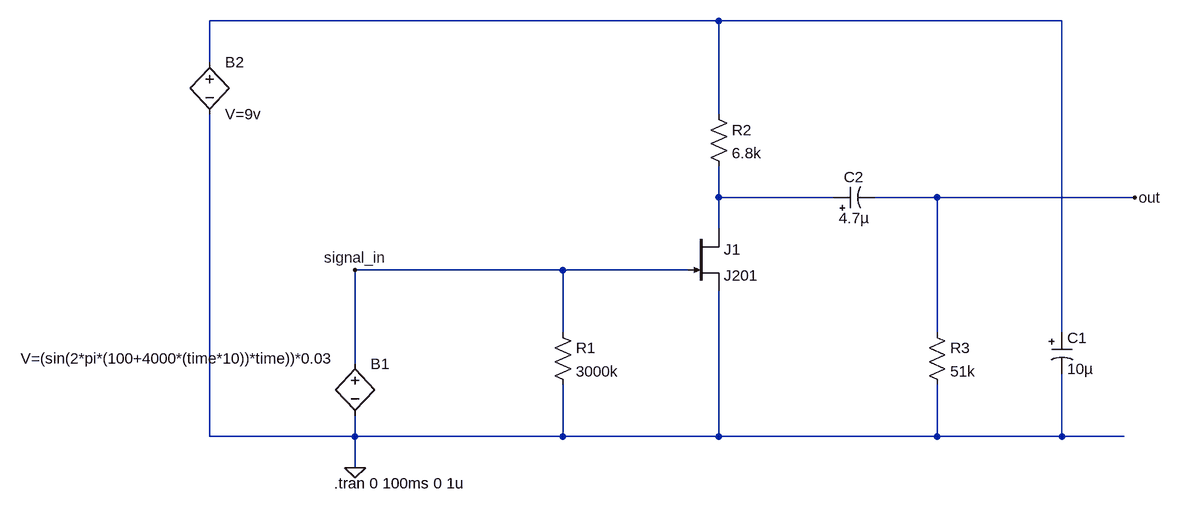
[diagram p0: schematic original.asc]
original.asc, the LTspice schematic file:
Version 4
SHEET 1 1288 680
WIRE 592 -384 -192 -384
WIRE 1120 -384 592 -384
WIRE -192 -320 -192 -384
WIRE 592 -240 592 -384
WIRE 592 -112 592 -160
WIRE 768 -112 592 -112
WIRE 928 -112 832 -112
WIRE 1232 -112 928 -112
WIRE 592 -64 592 -112
WIRE 352 0 32 0
WIRE 544 0 352 0
WIRE 352 96 352 0
WIRE 928 96 928 -112
WIRE 1120 96 1120 -384
WIRE 32 144 32 0
WIRE -192 256 -192 -240
WIRE 32 256 32 224
WIRE 32 256 -192 256
WIRE 352 256 352 176
WIRE 352 256 32 256
WIRE 592 256 592 32
WIRE 592 256 352 256
WIRE 928 256 928 176
WIRE 928 256 592 256
WIRE 1120 256 1120 160
WIRE 1120 256 928 256
WIRE 1216 256 1120 256
WIRE 32 304 32 256
FLAG 32 304 0
FLAG 32 0 signal_in
FLAG 1232 -112 out
SYMBOL bv 32 128 R0
WINDOW 3 -27 8 Right 2
SYMATTR Value V=(sin(2*pi*(100+4000*(time*10))*time))*0.03
SYMATTR InstName B1
SYMBOL njf 544 -64 R0
SYMATTR InstName J1
SYMATTR Value J201
SYMBOL res 336 80 R0
SYMATTR InstName R1
SYMATTR Value 3000k
SYMBOL res 576 -256 R0
SYMATTR InstName R2
SYMATTR Value 6.8k
SYMBOL res 912 80 R0
SYMATTR InstName R3
SYMATTR Value 51k
SYMBOL polcap 768 -96 R270
WINDOW 0 32 32 VTop 2
WINDOW 3 0 32 VBottom 2
SYMATTR InstName C2
SYMATTR Value 4.7µ
SYMATTR Description Capacitor
SYMATTR Type cap
SYMATTR SpiceLine V=16 Irms=0 Rser=8 Lser=0
SYMBOL bv -192 -336 R0
SYMATTR InstName B2
SYMATTR Value V=9v
SYMBOL polcap 1104 96 R0
SYMATTR InstName C1
SYMATTR Value 10µ
SYMATTR Description Capacitor
SYMATTR Type cap
SYMATTR SpiceLine V=16 Irms=0 Rser=8 Lser=0
TEXT 0 328 Left 2 !.tran 0 100ms 0 1u

The netlist it stands for:
* original.asc
B1 signal_in 0 V=(sin(2*pi*(100+4000*(time*10))*time))*0.03
J1 N002 signal_in 0 J201
R1 signal_in 0 3000k
R2 N001 N002 6.8k
R3 out 0 51k
C2 N002 out 4.7µ V=16 Irms=0 Rser=8 Lser=0
B2 N001 0 V=9v
C1 N001 0 10µ V=16 Irms=0 Rser=8 Lser=0
.model NJF NJF
.model PJF PJF
.lib standard.jft
.tran 0 100ms 0 1u
.backanno
.end